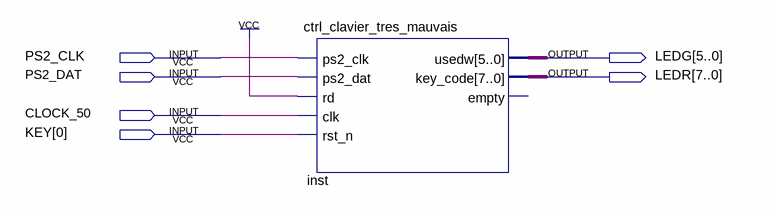
[diagram p0: schematic sheet]
// Quartus schematic partie1_top.bdf as structural Verilog: 1 symbols, 6 pins
module partie1_top (
  input  PS2_CLK,
  input  PS2_DAT,
  input  CLOCK_50,
  input  [0:0] KEY,
  output [5:0] LEDG,
  output [7:0] LEDR
);

  ctrl_clavier_tres_mauvais inst (
    .ps2_clk(PS2_CLK), .ps2_dat(PS2_DAT), .rd(1'b1), .clk(CLOCK_50), .rst_n(KEY[0]), .usedw(LEDG),
    .key_code(LEDR));  // open: empty
endmodule
